# EAGLE schematic STM32-breakout-v1.0 (EAGLE 5.07)
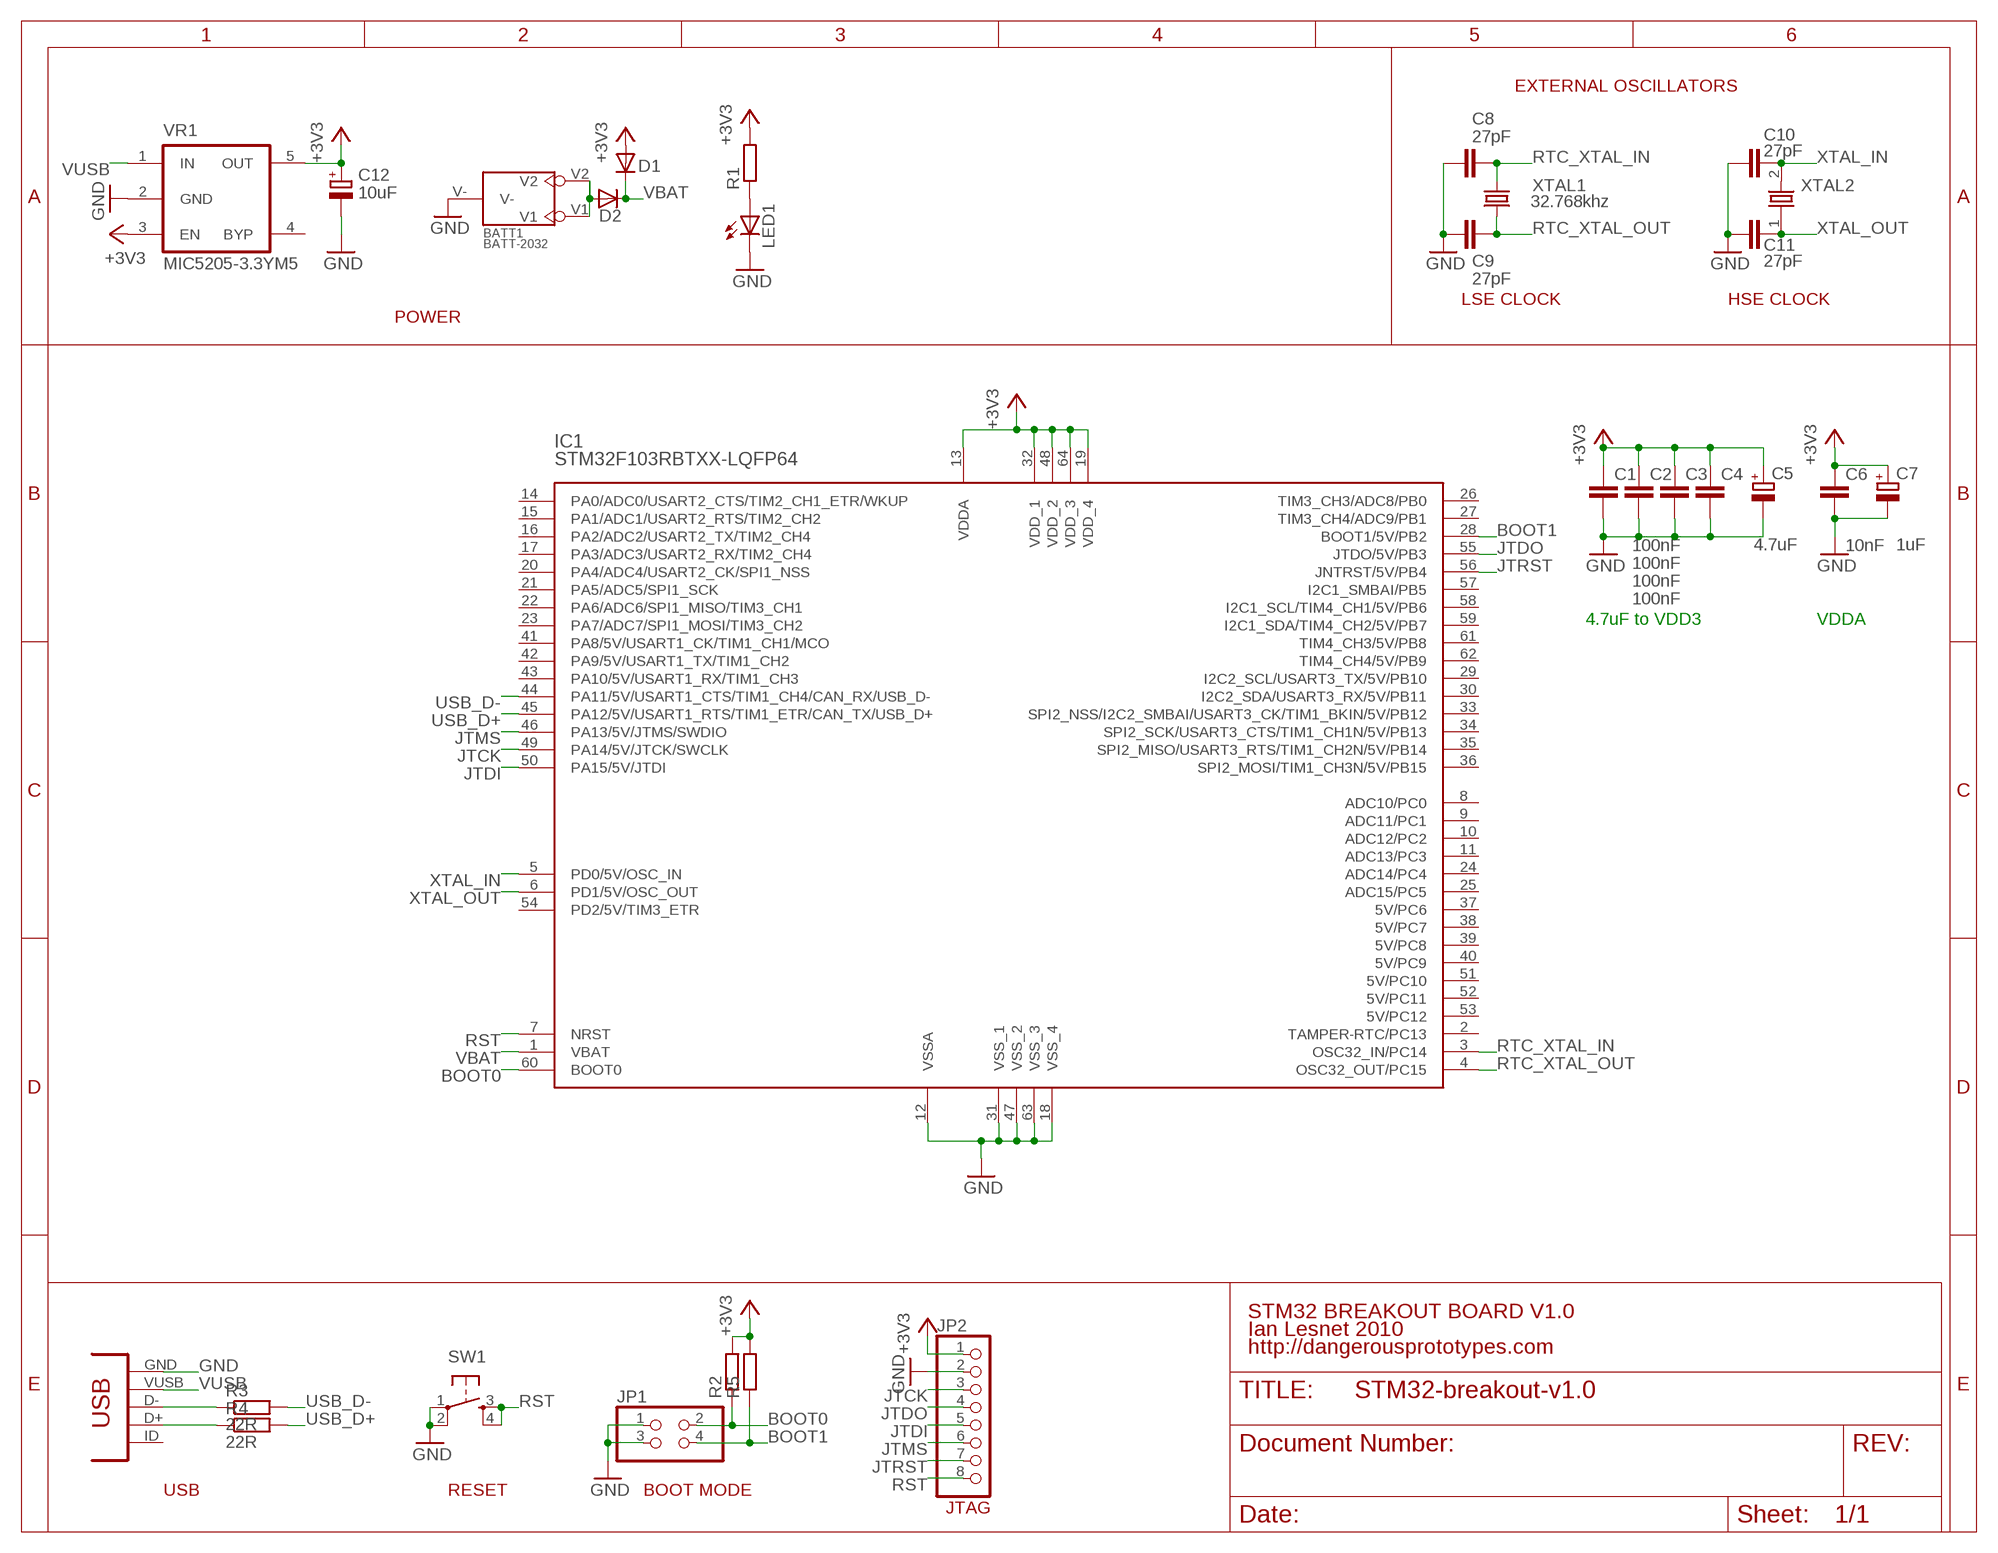
[diagram p0: schematic, sheet 1]

## Parts
BATT1  BATT-2032  [2032]
C1  100nF  CAPC603  [C603]
C2  100nF  CAPC603  [C603]
C3  100nF  CAPC603  [C603]
C4  100nF  CAPC603  [C603]
C5  4.7uF  CAP_POLSMC_A  [SMC_A]
C6  10nF  CAPC603  [C603]
C7  1uF  CAP_POLSMC_A  [SMC_A]
C8  27pF  CAPC603  [C603]
C9  27pF  CAPC603  [C603]
C10  27pF  CAPC603  [C603]
C11  27pF  CAPC603  [C603]
C12  10uF  CAP_POLSMC_A  [SMC_A]
CONN1  CONN_USB  [CONN_USB_MINI-B]
D1  DIODEDO323  [DO323]
D2  DIODEDO323  [DO323]
IC1  STM32F103RBTXX-LQFP64  [LQFP64]
JP1  PINHD-2X02_2.54  [2X02]
JP2  PINHD-1X08_2.54-S  [1X08-S]
LED1  LED805  [LED-805]
R1  RESISTORR603  [R603]
R2  RESISTORR603  [R603]
R3  22R  RESISTORR603  [R603]
R4  22R  RESISTORR603  [R603]
R5  RESISTORR603  [R603]
SW1  SMD_TACT_SMALL  [TACT_SWITCH_SMALL]
VR1  MIC5205-3.3YM5  MIC5205  [SOT-23-5]
XTAL1  32.768khz  CRYSTALTC26H  [TC26H]
XTAL2  CRYSTAL  [HC-49U]

## Nets
+3V3: C1.1 C2.1 C3.1 C4.1 C5.+ C6.1 C7.+ C12.+ D1.A IC1.13(VDDA) IC1.19(VDD_4) IC1.32(VDD_1) IC1.48(VDD_2) IC1.64(VDD_3) JP2.1 R1.2 R2.2 R5.2 VR1.3(EN) VR1.5(OUT)
BOOT0: IC1.60(BOOT0) JP1.2 R2.1
BOOT1: IC1.28(BOOT1/5V/PB2) JP1.4 R5.1
GND: BATT1.V- C1.2 C2.2 C3.2 C4.2 C5.- C6.2 C7.- C8.1 C9.1 C10.1 C11.1 C12.- CONN1.GND IC1.12(VSSA) IC1.18(VSS_4) IC1.31(VSS_1) IC1.47(VSS_2) IC1.63(VSS_3) JP1.1 JP1.3 JP2.2 LED1.C SW1.1 SW1.2 VR1.2(GND)
JTCK: IC1.49(PA14/5V/JTCK/SWCLK) JP2.3
JTDI: IC1.50(PA15/5V/JTDI) JP2.5
JTDO: IC1.55(JTDO/5V/PB3) JP2.4
JTMS: IC1.46(PA13/5V/JTMS/SWDIO) JP2.6
JTRST: IC1.56(JNTRST/5V/PB4) JP2.7
N$1: BATT1.V1 BATT1.V2 D2.A
N$2: LED1.A R1.1
N$3: CONN1.D- R3.1
N$4: CONN1.D+ R4.1
RST: IC1.7(NRST) JP2.8 SW1.3 SW1.4
RTC_XTAL_IN: C8.2 IC1.3(OSC32_IN/PC14) XTAL1.1
RTC_XTAL_OUT: C9.2 IC1.4(OSC32_OUT/PC15) XTAL1.2
USB_D+: IC1.45(PA12/5V/USART1_RTS/TIM1_ETR/CAN_TX/USB_D+) R4.2
USB_D-: IC1.44(PA11/5V/USART1_CTS/TIM1_CH4/CAN_RX/USB_D-) R3.2
VBAT: D1.C D2.C IC1.1(VBAT)
VUSB: CONN1.VUSB VR1.1(IN)
XTAL_IN: C10.2 IC1.5(PD0/5V/OSC_IN) XTAL2.2
XTAL_OUT: C11.2 IC1.6(PD1/5V/OSC_OUT) XTAL2.1
Unconnected: CONN1.BODY@1(BODY) CONN1.BODY@2(BODY) CONN1.BODY@3(BODY) CONN1.BODY@4(BODY) CONN1.ID(USBID) IC1.2(TAMPER-RTC/PC13) IC1.8(ADC10/PC0) IC1.9(ADC11/PC1) IC1.10(ADC12/PC2) IC1.11(ADC13/PC3) IC1.14(PA0/ADC0/USART2_CTS/TIM2_CH1_ETR/WKUP) IC1.15(PA1/ADC1/USART2_RTS/TIM2_CH2) IC1.16(PA2/ADC2/USART2_TX/TIM2_CH4) IC1.17(PA3/ADC3/USART2_RX/TIM2_CH4) IC1.20(PA4/ADC4/USART2_CK/SPI1_NSS) IC1.21(PA5/ADC5/SPI1_SCK) IC1.22(PA6/ADC6/SPI1_MISO/TIM3_CH1) IC1.23(PA7/ADC7/SPI1_MOSI/TIM3_CH2) IC1.24(ADC14/PC4) IC1.25(ADC15/PC5) IC1.26(TIM3_CH3/ADC8/PB0) IC1.27(TIM3_CH4/ADC9/PB1) IC1.29(I2C2_SCL/USART3_TX/5V/PB10) IC1.30(I2C2_SDA/USART3_RX/5V/PB11) IC1.33(SPI2_NSS/I2C2_SMBAI/USART3_CK/TIM1_BKIN/5V/PB12) IC1.34(SPI2_SCK/USART3_CTS/TIM1_CH1N/5V/PB13) IC1.35(SPI2_MISO/USART3_RTS/TIM1_CH2N/5V/PB14) IC1.36(SPI2_MOSI/TIM1_CH3N/5V/PB15) IC1.37(5V/PC6) IC1.38(5V/PC7) IC1.39(5V/PC8) IC1.40(5V/PC9) IC1.41(PA8/5V/USART1_CK/TIM1_CH1/MCO) IC1.42(PA9/5V/USART1_TX/TIM1_CH2) IC1.43(PA10/5V/USART1_RX/TIM1_CH3) IC1.51(5V/PC10) IC1.52(5V/PC11) IC1.53(5V/PC12) IC1.54(PD2/5V/TIM3_ETR) IC1.57(I2C1_SMBAI/PB5) IC1.58(I2C1_SCL/TIM4_CH1/5V/PB6) IC1.59(I2C1_SDA/TIM4_CH2/5V/PB7) IC1.61(TIM4_CH3/5V/PB8) IC1.62(TIM4_CH4/5V/PB9) VR1.4(BYP)

## Notes on the sheet
- EXTERNAL OSCILLATORS
- LSE CLOCK | HSE CLOCK
- POWER
- 4.7uF to VDD3 | VDDA
- STM32 BREAKOUT BOARD V1.0
- Ian Lesnet 2010
- http://dangerousprototypes.com
- USB | RESET | BOOT MODE
- JTAG

## Library data of the parts
BATT1 = dp_devices:BATT-2032
C1-C4 C6 C8-C11 = dp_devices:CAP
C5 C7 C12 = dp_devices:CAP_POL
CONN1 = dp_devices:CONN_USB: USB connector
D1 D2 = dp_devices:DIODE
IC1 = dp_devices:STM32F103RBTXX: 32-bit ARM-based MCU with 64 or 128KB Flash
JP1 = pinhead-2:PINHD-2X02: PIN HEADER
JP2 = pinhead-2:PINHD-1X08: PIN HEADER
LED1 = dp_devices:LED
R1-R5 = dp_devices:RESISTOR
SW1 = dp_devices:SMD_TACT_SMALL
VR1 = dp_devices:MIC5205: 150ma Low-Noise LDO Regulator
XTAL1 = crystal:CRYSTAL: CRYSTAL
XTAL2 = dp_devices:CRYSTAL